# EasyEDA schematic SCH_miniArcade.json
TITLE: Sheet_1; REV: 1.0; Date: 2026-01-26; Sheet: 1/1; Drawn By: jonatan_t; Company: Jonathan Torfstein
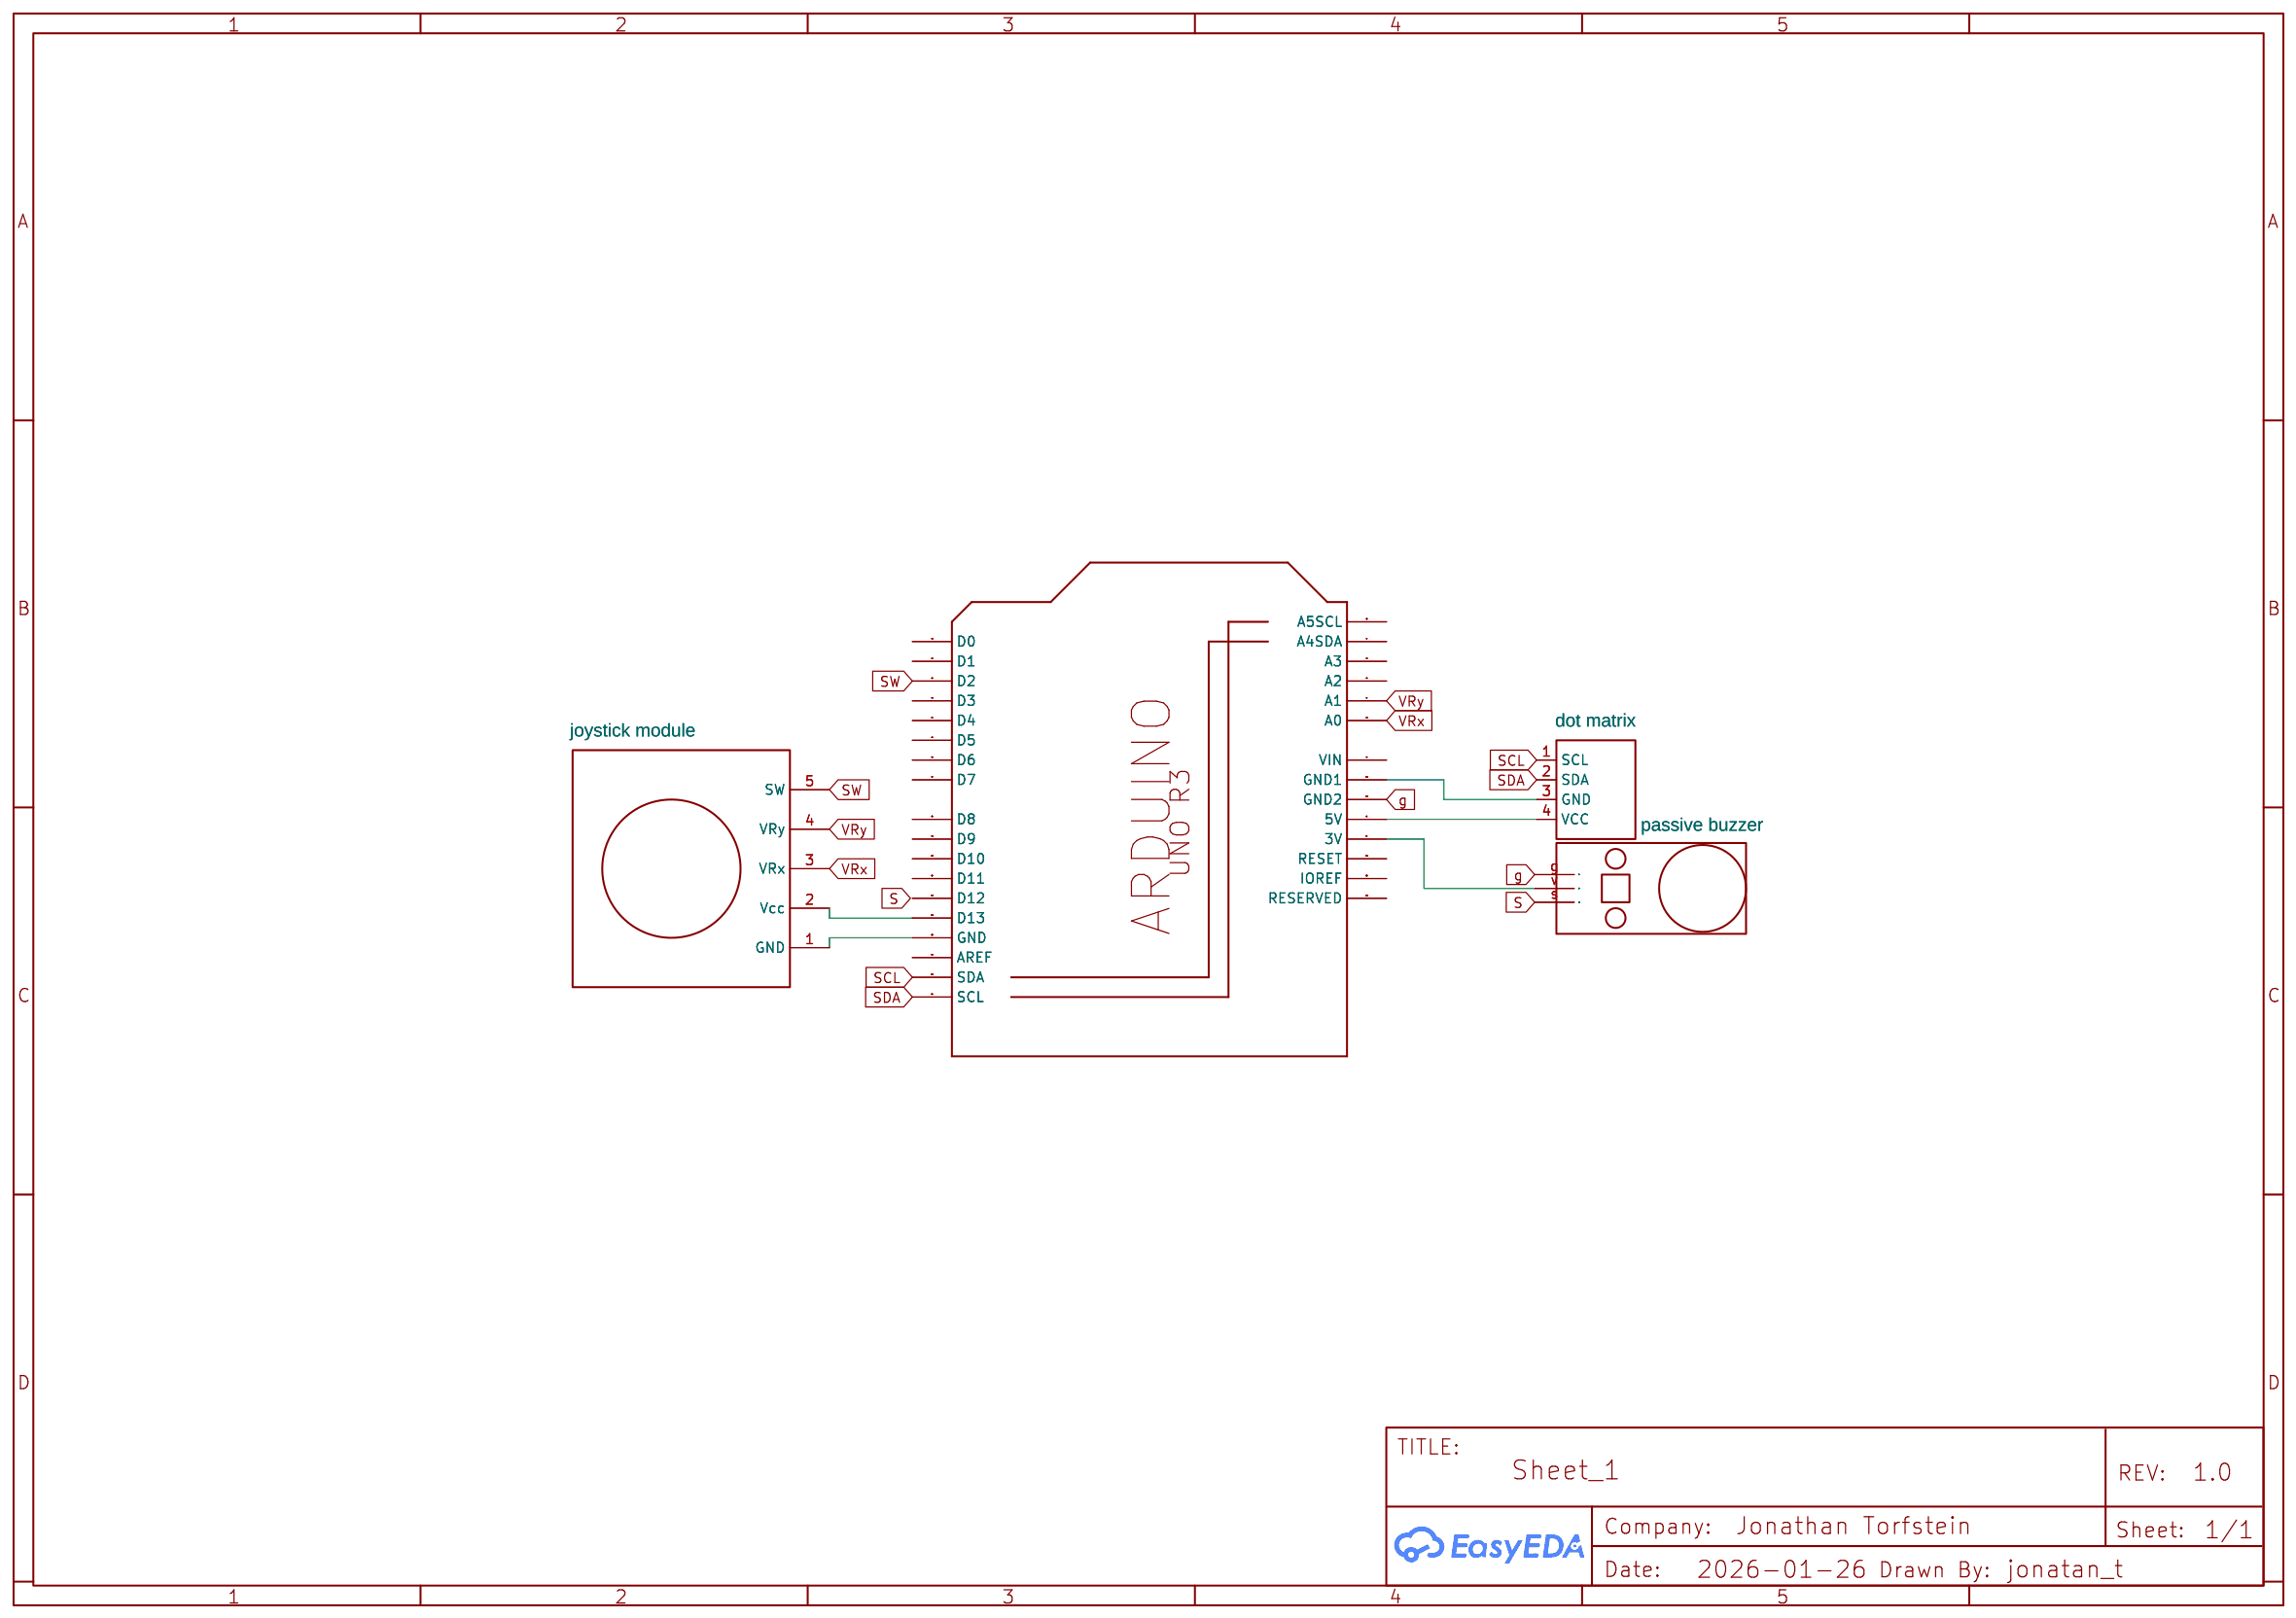
[diagram p0: schematic sheet]

## Parts
U1  ARDUINOR3-DIMENSION  [ARDUINOR3]
U2  dot matrix  [CONN-TH_4P-P5.08_TE-CONNECTIVITY_350424-1]
U3  joystick module  [HW-504JOYSTICK]
U4  passive buzzer

## Library data of the parts
U1 = ARDUINOR3-DIMENSION: This is a new object for the new Arduino R3 - with extra pins that you may want to use (such as IOref, and duplicated A4A5; Contributor: Adafruit
U2 = 350424-1: Manufacturer: TE Connectivity(泰科电子); Supplier: LCSC; Supplier Part: C573090; Contributor: NeMesiS34
U3 = HW-504JOYSTICK: Contributor: williamthales
U4 = keystudio passive buzzer: Contributor: jonatan_t

## Nets
g: U1.GND2 U4.g(1)
S: U4.s(3)
SCL: U1.SDA U2.1(SCL)
SDA: U1.SCL U2.2(SDA)
SW: U1.D2 U3.5(SW)
VRx: U1.A0 U3.3(VRx)
VRy: U1.A1 U3.4(VRy)
Net-(U1-3V): U1.3V U4.v(2)
Net-(U1-5V): U1.5V U2.4(VCC)
Net-(U1-D13): U1.D13 U3.2(Vcc)
Net-(U1-GND1): U1.GND1 U2.3(GND)
Net-(U1-GND): U1.GND U3.1(GND)

Not connected (* = marked no-connect by the designer): U1 A2 A3 A4(A4SDA) A5(A5SCL) AREF D0 D1 D3 D4 D5 D6 D7 D8 D9 D10 D11 D12 IOREF RESERVED RESET VIN
